# Altium schematic sheet uc.SchDoc
size 420 x 297 mm; SheetNumber: 2; Обозначение документа: QFP uC; Номер листа: 2; Общее количество листов: 9
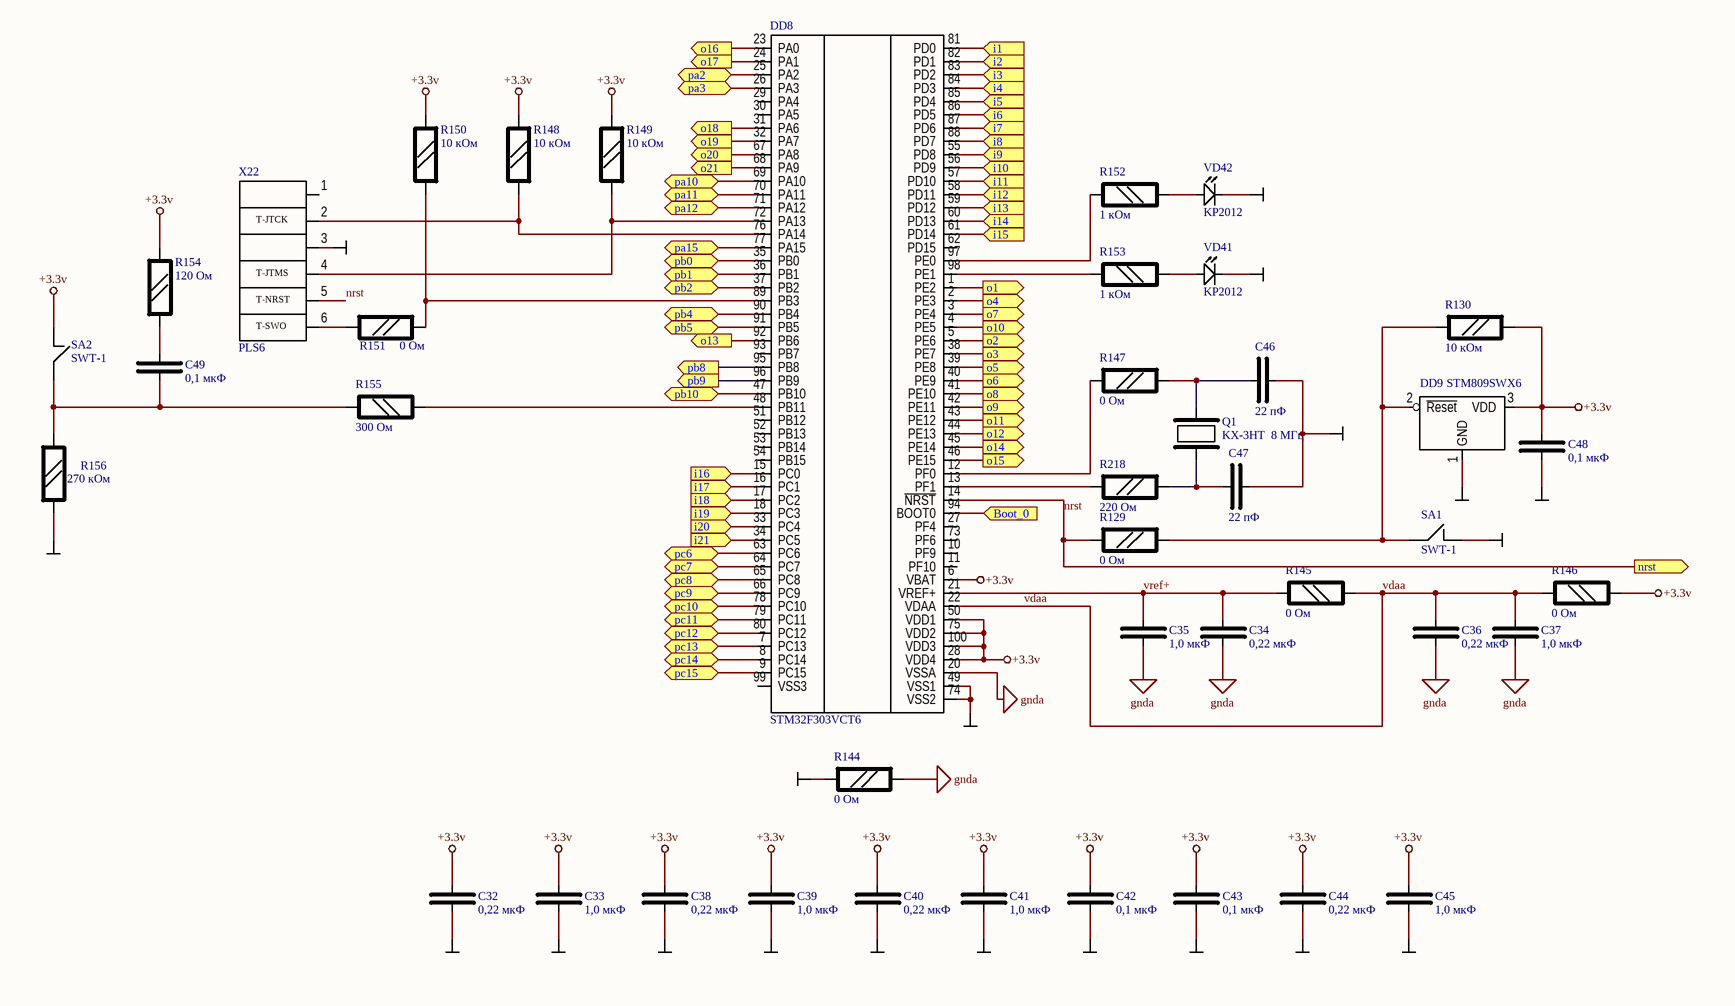
[diagram p0: uc.SchDoc]

## Parts
C32  0,22 мкФ  [SMD0805CAP]
C33  1,0 мкФ  [SMD0805CAP]
C34  0,22 мкФ  [SMD0805CAP]
C35  1,0 мкФ  [SMD0805CAP]
C36  0,22 мкФ  [SMD0805CAP]
C37  1,0 мкФ  [SMD0805CAP]
C38  0,22 мкФ  [SMD0805CAP]
C39  1,0 мкФ  [SMD0805CAP]
C40  0,22 мкФ  [SMD0805CAP]
C41  1,0 мкФ  [SMD0805CAP]
C42  0,1 мкФ  [SMD0805CAP]
C43  0,1 мкФ  [SMD0805CAP]
C44  0,22 мкФ  [SMD0805CAP]
C45  1,0 мкФ  [SMD0805CAP]
C46  22 пФ  [SMD0805CAP]
C47  22 пФ  [SMD0805CAP]
C48  0,1 мкФ  [SMD0805CAP]
C49  0,1 мкФ  [SMD0805CAP]
DD8  STM32F303VCT6  [LQFP100]
DD9  STM809SWX6  [SOT-23]
Q1  KX-3HT  8 МГц  [HC49_S]
R129  0 Ом  [SMD0805RES]
R130  10 кОм  [SMD0805RES]
R144  0 Ом  [SMD0805RES]
R145  0 Ом  [SMD0805RES]
R146  0 Ом  [SMD0805RES]
R147  0 Ом  [SMD0805RES]
R148  10 кОм  [SMD0805RES]
R149  10 кОм  [SMD0805RES]
R150  10 кОм  [SMD0805RES]
R151  0 Ом  [SMD0805RES]
R152  1 кОм  [SMD0805RES]
R153  1 кОм  [SMD0805RES]
R154  120 Ом  [SMD0805RES]
R155  300 Ом  [SMD0805RES]
R156  270 кОм  [SMD0805RES]
R218  220 Ом  [SMD0805RES]
SA1  SWT-1  [SWT-1]
SA2  SWT-1  [SWT-1]
VD41  KP2012  [SMD0805DIO_C]
VD42  KP2012  [SMD0805DIO_C]
X22  PLS6  [PLS6]

## Ports
i1 (in), i2 (in), i3 (in), i4 (in), i5 (in), i6 (in), i7 (in), i8 (in), i9 (in), i10 (in), i11 (in), i12 (in), i13 (in), i14 (in), i15 (in), i16 (in), i17 (in), i18 (in), i19 (in), i20 (in), i21 (in), nrst (out), o1 (out), o2 (out), o3 (out), o4 (out), o5 (out), o6 (out), o7 (out), o8 (out), o9 (out), o10 (out), o11 (out), o12 (out), o13 (out), o14 (out), o15 (out), o16 (out), o17 (out), o18 (out), o19 (out), o20 (out), o21 (out), pa2 (bidir), pa3 (bidir), pa10 (bidir), pa11 (bidir), pa12 (bidir), pa15 (bidir), pb0 (bidir), pb1 (bidir), pb2 (bidir), pb4 (bidir), pb5 (bidir), pb8 (out), pb9 (out), pb10 (bidir), pс6 (bidir), pс7 (bidir), pс8 (bidir), pс9 (bidir), pс10 (bidir), pс11 (bidir), pс12 (bidir), pс13 (bidir), pс14 (bidir), pс15 (bidir), Вооt_0 (in)

## Nets
+3.3v: C32.1 C33.1 C38.1 C39.1 C40.1 C41.1 C42.1 C43.1 C44.1 C45.1 C48.1 DD8.6(VBAT) DD8.28(VDD4) DD8.50(VDD1) DD8.75(VDD2) DD8.100(VDD3) DD9.3(VDD) R130.2 R146.1 R148.2 R149.2 R150.2 R154.1 SA2.2
GND: C32.2 C33.2 C38.2 C39.2 C40.2 C41.2 C42.2 C43.2 C44.2 C45.2 C46.2 C47.2 C48.2 DD8.49(VSS1) DD8.74(VSS2) DD9.1(GND) R144.1 R156.2 SA1.2 VD41.1(Cathode) VD42.1(Cathode) X22.3
gnda: C34.2 C35.2 C36.2 C37.2 DD8.20(VSSA) R144.2
i1: DD8.81(PD0) ; port i1
i2: DD8.82(PD1) ; port i2
i3: DD8.83(PD2) ; port i3
i4: DD8.84(PD3) ; port i4
i5: DD8.85(PD4) ; port i5
i6: DD8.86(PD5) ; port i6
i7: DD8.87(PD6) ; port i7
i8: DD8.88(PD7) ; port i8
i9: DD8.55(PD8) ; port i9
i10: DD8.56(PD9) ; port i10
i11: DD8.57(PD10) ; port i11
i12: DD8.58(PD11) ; port i12
i13: DD8.59(PD12) ; port i13
i14: DD8.60(PD13) ; port i14
i15: DD8.61(PD14) ; port i15
i16: DD8.15(PC0) ; port i16
i17: DD8.16(PC1) ; port i17
i18: DD8.17(PC2) ; port i18
i19: DD8.18(PC3) ; port i19
i20: DD8.33(PC4) ; port i20
i21: DD8.34(PC5) ; port i21
nrst: DD8.14(~{NRST}) R129.1 X22.5 ; port nrst
o1: DD8.1(PE2) ; port o1
o2: DD8.5(PE6) ; port o2
o3: DD8.38(PE7) ; port o3
o4: DD8.2(PE3) ; port o4
o5: DD8.39(PE8) ; port o5
o6: DD8.40(PE9) ; port o6
o7: DD8.3(PE4) ; port o7
o8: DD8.41(PE10) ; port o8
o9: DD8.42(PE11) ; port o9
o10: DD8.4(PE5) ; port o10
o11: DD8.43(PE12) ; port o11
o12: DD8.44(PE13) ; port o12
o13: DD8.92(PB6) ; port o13
o14: DD8.45(PE14) ; port o14
o15: DD8.46(PE15) ; port o15
o16: DD8.23(PA0) ; port o16
o17: DD8.24(PA1) ; port o17
o18: DD8.31(PA6) ; port o18
o19: DD8.32(PA7) ; port o19
o20: DD8.67(PA8) ; port o20
o21: DD8.68(PA9) ; port o21
pa2: DD8.25(PA2) ; port pa2
pa3: DD8.26(PA3) ; port pa3
pa10: DD8.69(PA10) ; port pa10
pa11: DD8.70(PA11) ; port pa11
pa12: DD8.71(PA12) ; port pa12
pa15: DD8.77(PA15) ; port pa15
pb0: DD8.35(PB0) ; port pb0
pb1: DD8.36(PB1) ; port pb1
pb2: DD8.37(PB2) ; port pb2
pb4: DD8.90(PB4) ; port pb4
pb5: DD8.91(PB5) ; port pb5
pb8: DD8.95(PB8) ; port pb8
pb9: DD8.96(PB9) ; port pb9
pb10: DD8.47(PB10) ; port pb10
pс6: DD8.63(PC6) ; port pс6
pс7: DD8.64(PC7) ; port pс7
pс8: DD8.65(PC8) ; port pс8
pс9: DD8.66(PC9) ; port pс9
pс10: DD8.78(PC10) ; port pс10
pс11: DD8.79(PC11) ; port pс11
pс12: DD8.80(PC12) ; port pс12
pс13: DD8.7(PC13) ; port pс13
pс14: DD8.8(PC14) ; port pс14
pс15: DD8.9(PC15) ; port pс15
vdaa: C36.1 C37.1 DD8.22(VDAA) R145.1 R146.2
vref+: C34.1 C35.1 DD8.21(VREF+) R145.2
Вооt_0: DD8.94(BOOT0) ; port Вооt_0
NetC46_1: C46.1 Q1.1 R147.2
NetC47_1: C47.1 Q1.2 R218.2
NetC49_1: C49.1 R154.2
NetC49_2: C49.2 R155.2 R156.1 SA2.1
NetDD8_12: DD8.12(PF0) R147.1
NetDD8_13: DD8.13(PF1) R218.1
NetDD8_48: DD8.48(PB11) R155.1
NetDD8_72: DD8.72(PA13) R149.1 X22.4
NetDD8_76: DD8.76(PA14) R148.1 X22.2
NetDD8_89: DD8.89(PB3) R150.1 R151.2
NetDD8_97: DD8.97(PE0) R152.1
NetDD8_98: DD8.98(PE1) R153.1
NetDD9_2: DD9.2(~{Reset}) R129.2 R130.1 SA1.1
NetR151_1: R151.1 X22.6
NetR152_2: R152.2 VD42.2(Anode)
NetR153_2: R153.2 VD41.2(Anode)

Not connected (* = marked no-connect by the designer): DD8 10(PF9) 11(PF10) 27(PF4) 29(PA4) 30(PA5) 51(PB12) 52(PB13) 53(PB14) 54(PB15) 62(PD15) 73(PF6) 93(PB7) 99(VSS3); X22 1

## Notes on the sheet
- (near X22) T-JTCK
- (near X22) T-NRST
- (near X22) T-JTMS
- (near X22) T-SWO
- Подп. и дата
- Инв. № дубл.
- Взам. инв. №
- Инв. № подл.
- Изм.
- Лист
- № докум.
- Подп.
- Дата
- Копировал
- Формат А3

## Library data of the parts
C32-C45 C48 C49 = C0805: Чип конденсатор 0805; Voltage: 50V; Vendor: Generic; Temp: Y5V; Tol: 20%; SolderOpton: Norm; Price: 2
  C32 C34 C36 C38 C40 C44: Value: 0,22 мкФ
  C33 C35 C37 C39 C41 C45: Value: 1,0 мкФ
  C42 C43 C48 C49: Value: 0,1 мкФ
C46 = C0805: Чип конденсатор 0805; Voltage: 50V; Vendor: Generic; Temp: Y5V; Tol: NPO; SolderOpton: Norm; Value: 22 пФ; Price: 2
C47 = C0805: Чип конденсатор 0805; Voltage: 50V; Vendor: Generic; Temp: Y5V; Tol: NPO; SolderOption: Norm; Value: 22 пФ; Price: 2
DD8 = STM32F303VCT6: ARM Cortex3; Vendor: STM; SolderOption: Norm; Value: STM32F303VCT6; Price: 600
DD9 = STM809SWX6: Reset генератор; Vendor: STM; Voltage: 3V3; SolderOption: Norm; Value: STM809SWX6; Price: 20
Q1 = KX-3HT: Резонатор кварцевый; Vendor: Geyer; SolderOption: Norm; Price: 50; Value: KX-3HT  8 МГц
R129 R130 R144-R147 R151-R156 R218 = R0805: Чип резистор 0805; Vendor: Generic; Tolerance: 5%; SolderOpton: Norm; Price: 2
  R129 R144-R147 R151: Value: 0 Ом
  R130: Value: 10 кОм
  R152 R153: Value: 1 кОм
  R154: Value: 120 Ом
  R155: Value: 300 Ом
  R156: Value: 270 кОм
  R218: Value: 220 Ом
R148-R150 = R0805: Чип резистор 0805; Vendor: Generic; Tolerance: 1%; SolderOpton: Norm; Price: 2; Value: 10 кОм
SA1 SA2 = SWT1: Кнопка тактовая; Vendor: KLS; Voltage: 12; SolderOption: Norm; Price: 10; Value: SWT-1
VD41 VD42 = KP2012_C: Чип светодиод 0805; Vendor: KB; Color: Green; SolderOpton: Norm; Price: 20; Value: KP2012
X22 = PLS6: Вилка  PLS 6x2.54; Vendor: Confly; SolderOption: Norm; Price: 5; Value: PLS6